# EAGLE schematic Main_Body_PCB_V4 (EAGLE 9.6.2)
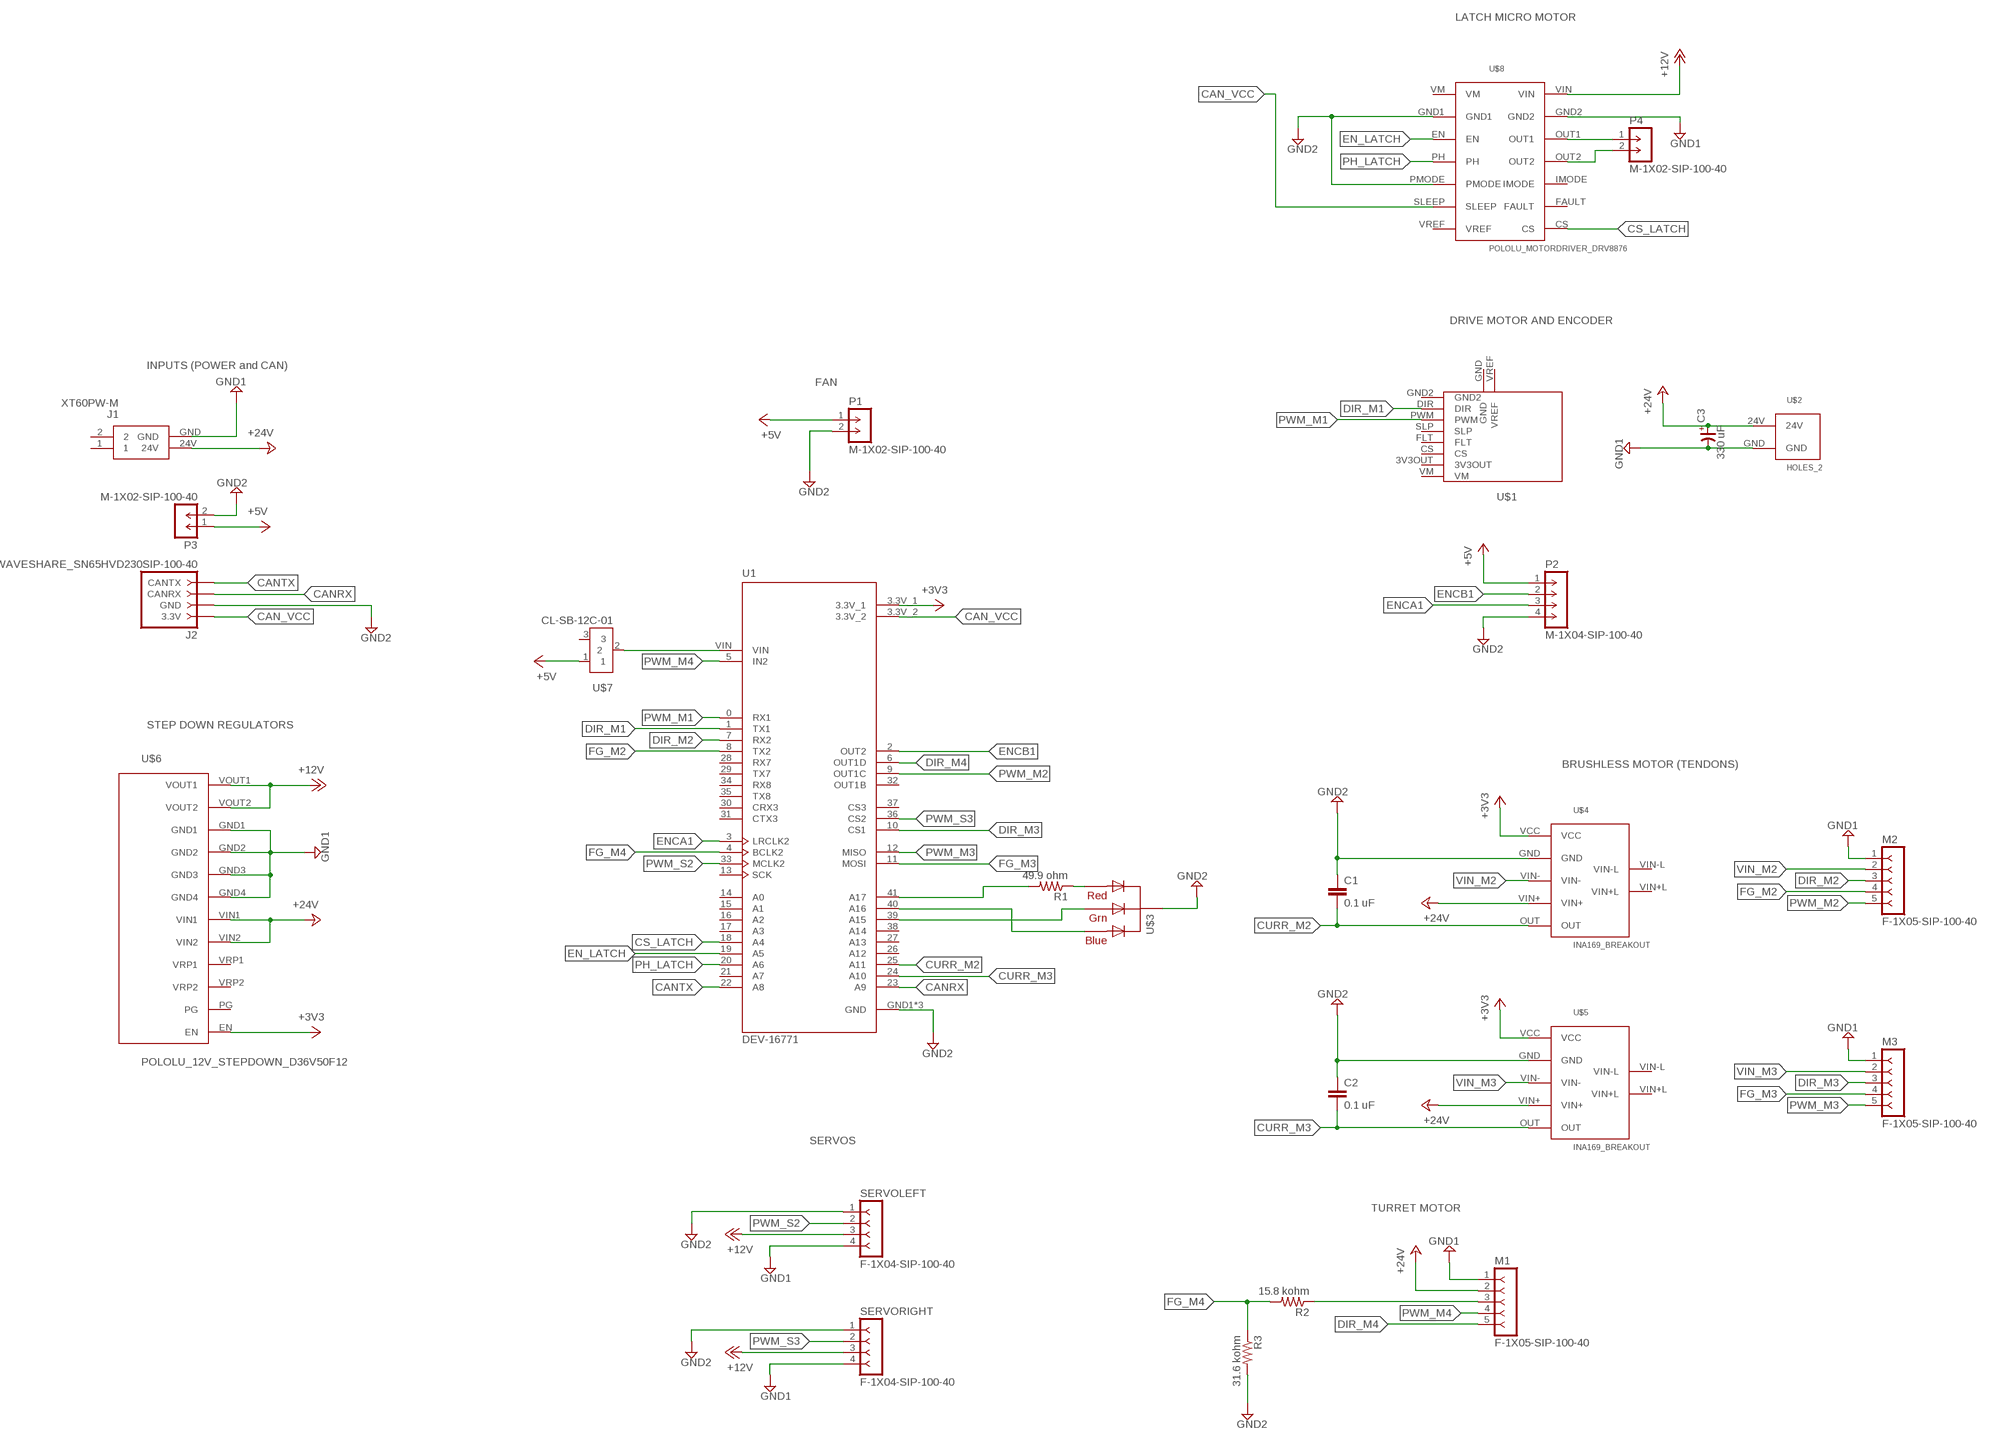
[diagram p0: schematic, sheet 1]

## Parts
C1  0.1 uF  C10/4  [C10B4]
C2  0.1 uF  C10/4  [C10B4]
C3  330 uF  CP_E-050X100  [CE-050X100]
J1  XT60PW-M  [XT60PWM]
J2  WAVESHARE_SN65HVD230SIP-100-40  [SIP-100-04-40_PPTC041LGBN-RC]
M1  F-1X05-SIP-100-40  [SIP-100-05-40]
M2  F-1X05-SIP-100-40  [SIP-100-05-40]
M3  F-1X05-SIP-100-40  [SIP-100-05-40]
P1  M-1X02-SIP-100-40  [SIP-100-02-40]
P2  M-1X04-SIP-100-40  [SIP-100-04-40]
P3  M-1X02-SIP-100-40  [SIP-100-02-40]
P4  M-1X02-SIP-100-40  [SIP-100-02-40]
R1  49.9 ohm  R-US_0204/7  [0204/7]
R2  15.8 kohm  R-US_0204/7  [0204/7]
R3  31.6 kohm  R-US_0204/7  [0204/7]
SERVOLEFT  F-1X04-SIP-100-40  [SIP-100-04-40]
SERVORIGHT  F-1X04-SIP-100-40  [SIP-100-04-40]
U1  DEV-16771  [MODULE_DEV-16771]
U$1  POLOLU_MOTORDRIVER_18V25_MOD  [MODULE_POLOLU_2992/2994_MOD]
U$2  HOLES_2  [HOLES_2]
U$3  KINGBRIGHT_LED  [LEDWP154A4SUREQBFZGW]
U$4  INA169_BREAKOUT  [MODULE_INA169_BREAKOUT]
U$5  INA169_BREAKOUT  [MODULE_INA169_BREAKOUT]
U$6  POLOLU_12V_STEPDOWN_D36V50F12  [MODULE_POLOLU_4093]
U$7  CL-SB-12C-01  [CL-SB-12C-01]
U$8  POLOLU_MOTORDRIVER_DRV8876  [MODULE_POLOLU_4036]

## Nets
+3V3: U1.3.3V_1 U$4.VCC U$5.VCC U$6.EN
+5V: P1.1 P2.1 P3.1 U$7.1
+12V: SERVOLEFT.3 SERVORIGHT.3 U$6.VOUT1 U$6.VOUT2 U$8.VIN
+24V: C3.+ J1.24V M1.2 U$2.24V U$4.VIN+ U$5.VIN+ U$6.VIN1 U$6.VIN2
CAN_VCC: J2.3.3V U1.3.3V_2 U$8.SLEEP
CANRX: J2.CANRX U1.23(A9)
CANTX: J2.CANTX U1.22(A8)
CS_LATCH: U1.18(A4) U$8.CS
CURR_M2: C1.2 U1.25(A11) U$4.OUT
CURR_M3: C2.2 U1.24(A10) U$5.OUT
DIR_M1: U1.1(TX1) U$1.DIR
DIR_M2: M2.3 U1.7(RX2)
DIR_M3: M3.3 U1.10(CS1)
DIR_M4: M1.5 U1.6(OUT1D)
EN_LATCH: U1.19(A5) U$8.EN
ENCA1: P2.3 U1.3(LRCLK2)
ENCB1: P2.2 U1.2(OUT2)
FG_M2: M2.4 U1.8(TX2)
FG_M3: M3.4 U1.11(MOSI)
FG_M4: R2.2 R3.1 U1.4(BCLK2)
GND1: C3.- J1.GND M1.1 M2.1 M3.1 SERVOLEFT.4 SERVORIGHT.4 U$2.GND U$6.GND1 U$6.GND2 U$6.GND3 U$6.GND4 U$8.GND2
GND2: C1.1 C2.1 J2.GND P1.2 P2.4 P3.2 R3.2 SERVOLEFT.1 SERVORIGHT.1 U1.GND1(GND) U1.GND2(GND) U1.GND3(GND) U$3.GND U$4.GND U$5.GND U$8.GND1 U$8.PMODE
N$1: U1.VIN U$7.2
N$2: U1.40(A16) U$3.BLU(BLUE)
N$3: R1.1 U$3.RED
N$4: M1.3 R2.1
N$7: R1.2 U1.41(A17)
N$8: U1.39(A15) U$3.GRN(GREEN)
N$11: P4.1 U$8.OUT1
N$12: P4.2 U$8.OUT2
PH_LATCH: U1.20(A6) U$8.PH
PWM_M1: U1.0(RX1) U$1.PWM
PWM_M2: M2.5 U1.9(OUT1C)
PWM_M3: M3.5 U1.12(MISO)
PWM_M4: M1.4 U1.5(IN2)
PWM_S2: SERVOLEFT.2 U1.33(MCLK2)
PWM_S3: SERVORIGHT.2 U1.36(CS2)
VIN_M2: M2.2 U$4.VIN-
VIN_M3: M3.2 U$5.VIN-
Unconnected: J1.1 J1.2 U1.13(SCK) U1.14(A0) U1.15(A1) U1.16(A2) U1.17(A3) U1.21(A7) U1.26(A12) U1.27(A13) U1.28(RX7) U1.29(TX7) U1.30(CRX3) U1.31(CTX3) U1.32(OUT1B) U1.34(RX8) U1.35(TX8) U1.37(CS3) U1.38(A14) U$1.3V3OUT U$1.CS U$1.FLT U$1.GND U$1.GND2 U$1.SLP U$1.VM U$1.VREF U$4.VIN+L U$4.VIN-L U$5.VIN+L U$5.VIN-L U$6.PG U$6.VRP1 U$6.VRP2 U$7.3 U$8.FAULT U$8.IMODE U$8.VM U$8.VREF

## Notes on the sheet
- LATCH MICRO MOTOR
- DRIVE MOTOR AND ENCODER
- INPUTS (POWER and CAN)
- FAN
- STEP DOWN REGULATORS
- BRUSHLESS MOTOR (TENDONS)
- SERVOS
- TURRET MOTOR

## Library data of the parts
C1 C2 = capacitor-wima:C: CAPACITOR naming: grid - package width
C3 = rc-master:CP_: POLARIZED CAP
J1 = Prune_Bot_V1:XT60PW-M: Socket; DC supply; XT60; male; PIN: 2; on PCBs; THT; Colour: yellow Source: Datasheet <https://www.tme.eu/Document/9b8d0c5eb7094295f3d3112c214d3ade/XT60PW SPEC.pdf>; DESCRIPTION: Socket; DC supply; XT60; male; PIN: 2; on PCBs; THT; Colour: yellow; HEIGHT: 8.4mm; MANUFACTURER_NAME: Changzou Amass Elec; MANUFACTURER_PART_NUMBER: XT60PW-M
J2 = Prune_Bot_V1:WAVESHARE_SN65HVD230: FEMALE HEADER
M1-M3 = con-headers-jp:F-1X05-: FEMALE HEADER
P1 P3 P4 = con-headers-jp:M-1X02-: MALE HEADER
P2 = con-headers-jp:M-1X04-: MALE HEADER
R1-R3 = adafruit:R-US_: RESISTOR, American symbol
SERVOLEFT SERVORIGHT = con-headers-jp:F-1X04-: FEMALE HEADER
U1 = Prune_Bot_V1:DEV-16771: RT1062 Teensy 4.1 i.MX ARM Cortex-M7 MPU Embedded Evaluation Board Check prices <https://pricing.snapeda.com/parts/DEV-16771/SparkFun%20Electronics/view-part?ref=eda>; AVAILABILITY: In Stock; DESCRIPTION: RT1062 Teensy 4.1 i.MX ARM® Cortex®-M7 MPU Embedded Evaluation Board; MF: SparkFun Electronics; MP: DEV-16771; PACKAGE: None; PRICE: None; PURCHASE-URL: https://pricing.snapeda.com/search/part/DEV-16771/?ref=eda
U$1 = Prune_Bot_V1:POLOLU_MOTORDRIVER_18V25_MOD
U$2 = Prune_Bot_V1:HOLES_2
U$3 = Prune_Bot_V1:KINGBRIGHT_LED
U$4 U$5 = Prune_Bot_V1:INA169_BREAKOUT
U$6 = Prune_Bot_V1:POLOLU_12V_STEPDOWN_D36V50F12
U$7 = Prune_Bot_V1:CL-SB-12C-01
U$8 = Prune_Bot_V1:POLOLU_MOTORDRIVER_DRV8876